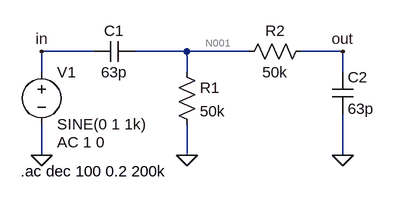
[diagram p0: schematic WorkingBPF.asc]
WorkingBPF.asc, the LTspice schematic file:
Version 4
SHEET 1 880 680
WIRE 0 96 -80 96
WIRE 144 96 64 96
WIRE 240 96 144 96
WIRE 384 96 320 96
WIRE -80 128 -80 96
WIRE 144 128 144 96
WIRE 384 128 384 96
WIRE -80 256 -80 208
WIRE 144 256 144 208
WIRE 384 256 384 192
FLAG 144 256 0
FLAG 384 256 0
FLAG -80 256 0
FLAG 384 96 out
FLAG -80 96 in
SYMBOL res 128 112 R0
SYMATTR InstName R1
SYMATTR Value 50k
SYMBOL cap 64 80 R90
WINDOW 0 0 32 VBottom 2
WINDOW 3 32 32 VTop 2
SYMATTR InstName C1
SYMATTR Value 63p
SYMBOL res 336 80 R90
WINDOW 0 0 56 VBottom 2
WINDOW 3 32 56 VTop 2
SYMATTR InstName R2
SYMATTR Value 50k
SYMBOL cap 368 128 R0
SYMATTR InstName C2
SYMATTR Value 63p
SYMBOL voltage -80 112 R0
WINDOW 123 24 124 Left 2
WINDOW 39 0 0 Left 0
SYMATTR Value2 AC 1 0
SYMATTR InstName V1
SYMATTR Value SINE(0 1 1k)
TEXT -112 280 Left 2 !.ac dec 100 0.2 200k

The netlist it stands for:
* WorkingBPF.asc
R1 N001 0 50k
C1 N001 in 63p
R2 out N001 50k
C2 out 0 63p
V1 in 0 SINE(0 1 1k) AC 1 0
.ac dec 100 0.2 200k
.backanno
.end

* Results of the author's LTspice run, read from the files saved beside the schematic
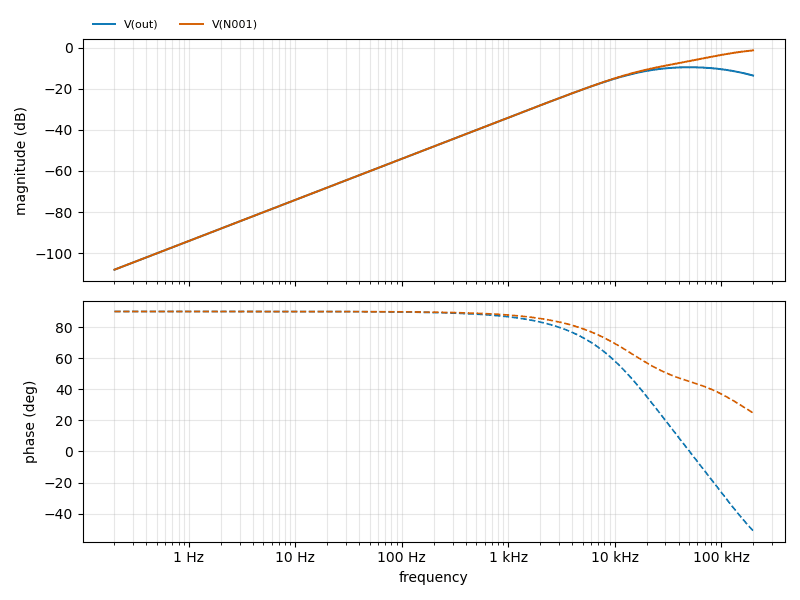
[diagram p1: AC Analysis of WorkingBPF.asc, plotted from the saved traces]
* AC Analysis, 1 run:
*   V(out): -108.05 dB at 200 mHz, -13.57 dB at 200 kHz, peak -9.54 dB at 50.24 kHz, 3 dB below the peak at 15.3 kHz and 166.9 kHz
*   V(N001): -108.05 dB at 200 mHz, -1.35 dB at 200 kHz, peak -1.35 dB at 200 kHz, 3 dB below the peak at 82.84 kHz